# Altium schematic sheet ESP32-C3 module.SchDoc: ESP32-C3-WROOM-02
size A4; Organization: TechLabs Global (Pvt) Ltd; DocumentNumber: 2; Revision: 1.1; SheetNumber: 2; SheetTotal: 2
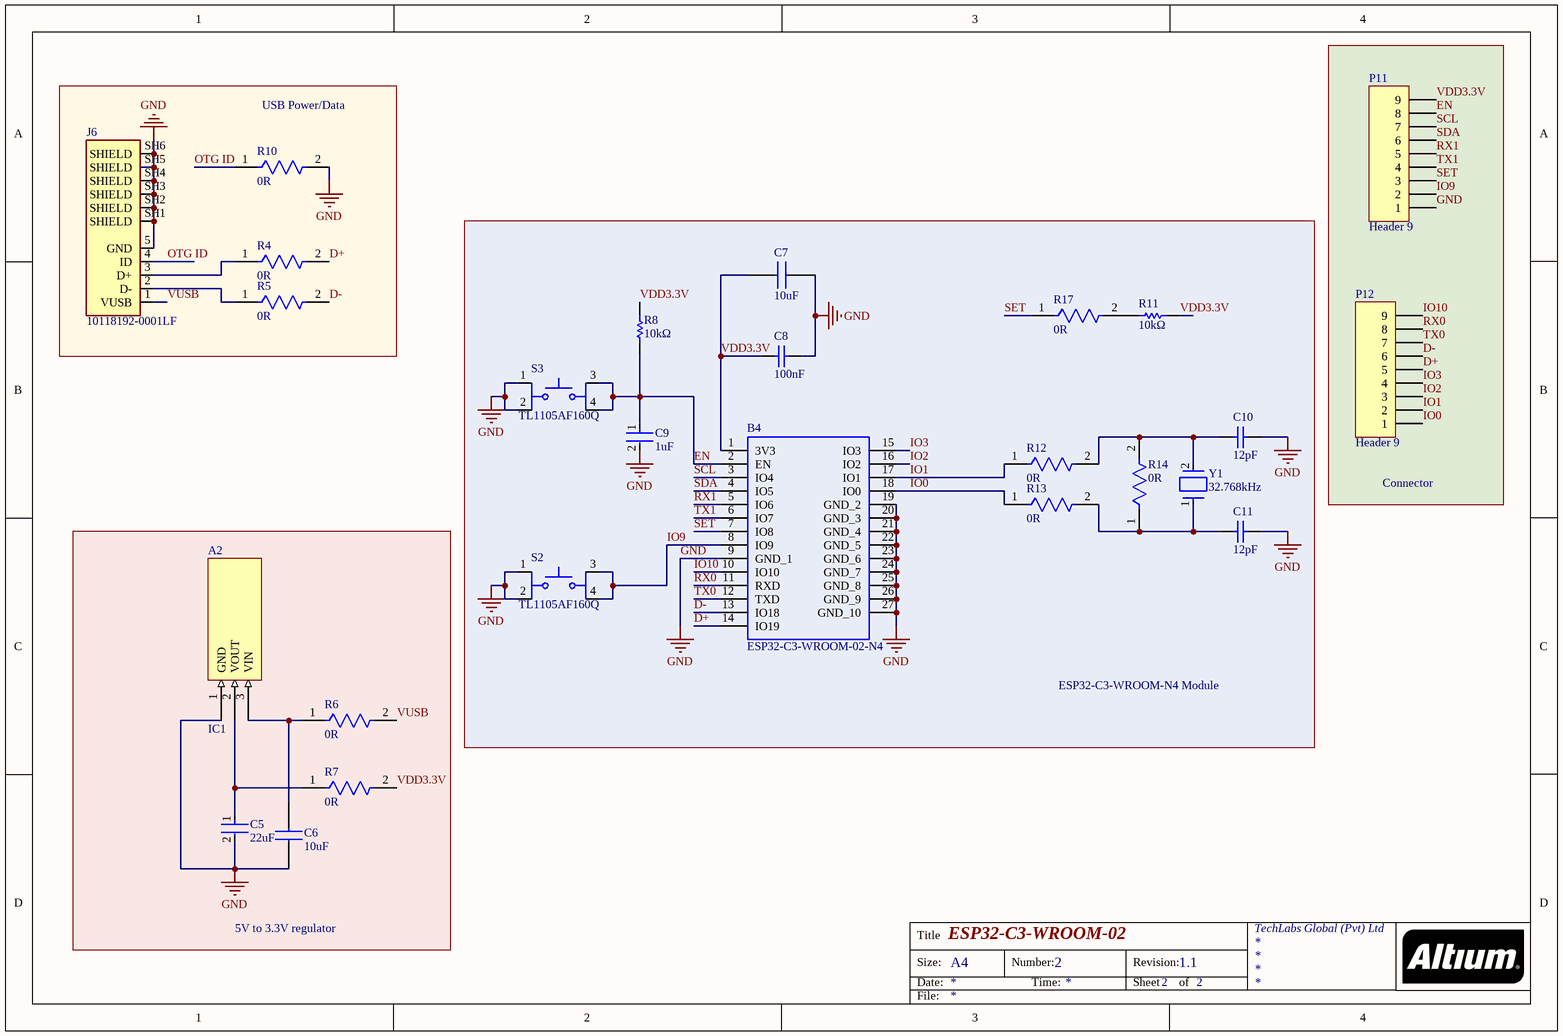
[diagram p0: ESP32-C3 module.SchDoc]

## Parts
A2  IC1  [SOT89-150P350X150-3N]
B4  ESP32-C3-WROOM-02-N4  [ESP32C3WROOM02N4]
C5  22uF  [FP-GRM219-0_2-0_15-IPC_A]
C6  10uF  [CL05A106MQ5NUNC]
C7  10uF  [CL05A106MQ5NUNC]
C8  100nF  [CAPC1050X55X23ML05T13]
C9  1uF  [FP-CL511-IPC_C]
C10  12pF  [CAPC1608X90X30LL10T20]
C11  12pF  [CAPC1608X90X30LL10T20]
J6  10118192-0001LF  [AMPHENOL_10118192-0001LF]
P11  Header 9  [HDR1X9]
P12  Header 9  [HDR1X9]
R4  0R  [FP-RC0402-0_4-IPC_A]
R5  0R  [FP-RC0402-0_4-IPC_A]
R6  0R  [FP-RC0402-0_4-IPC_A]
R7  0R  [FP-RC0402-0_4-IPC_A]
R8  10kΩ  [RESC1005X40X25LL05T10]
R10  0R  [FP-RC0402-0_4-IPC_A]
R11  10kΩ  [RESC1005X40X25LL05T10]
R12  0R  [FP-RC0402-0_4-IPC_A]
R13  0R  [FP-RC0402-0_4-IPC_A]
R14  0R  [FP-RC0402-0_4-IPC_A]
R17  0R  [FP-RC0402-0_4-IPC_A]
S2  TL1105AF160Q  [TL1105AF160Q]
S3  TL1105AF160Q  [TL1105AF160Q]
Y1  32.768kHz  [FP-ABS07-MFG]

## Blocks framed on the sheet
USB Power/Data: J6 R4 R5 R10
Connector: P11 P12
ESP32-C3-WROOM-N4 Module: B4 C7-C11 R8 R11-R14 R17 S2 S3 Y1
5V to 3.3V regulator: A2 C5 C6 R6 R7

## Nets
GND: A2.1(GND) B4.9(GND_1) B4.19(GND_2) B4.20(GND_3) B4.21(GND_4) B4.22(GND_5) B4.23(GND_6) B4.24(GND_7) B4.25(GND_8) B4.26(GND_9) B4.27(GND_10) C5.2 C6.1 C7.2 C8.2 C9.2 C10.2 C11.2 J6.5(GND) J6.SH1(SHIELD) J6.SH2(SHIELD) J6.SH3(SHIELD) J6.SH4(SHIELD) J6.SH5(SHIELD) J6.SH6(SHIELD) P11.1 R10.2 S2.1 S2.2 S3.1 S3.2
D+: B4.14(IO19) P12.5 R4.2
D-: B4.13(IO18) P12.6 R5.2
EN: B4.2(EN) C9.1 P11.8 R8.2 S3.3 S3.4
IO0: B4.18(IO0) P12.1 R13.1
IO1: B4.17(IO1) P12.2 R12.1
IO2: B4.16(IO2) P12.3
IO3: B4.15(IO3) P12.4
IO9: B4.8(IO9) P11.2 S2.3 S2.4
IO10: B4.10(IO10) P12.9
OTG ID: J6.4(ID) R10.1
RX0: B4.11(RXD) P12.8
RX1: B4.5(IO6) P11.5
SCL: B4.3(IO4) P11.7
SDA: B4.4(IO5) P11.6
SET: B4.7(IO8) P11.3 R17.1
TX0: B4.12(TXD) P12.7
TX1: B4.6(IO7) P11.4
VDD3.3V: B4.1(3V3) C7.1 C8.1 P11.9 R7.2 R8.1 R11.1
VUSB: J6.1(VUSB) R6.2
NetA2_2: A2.2(VOUT) C5.1 R7.1
NetA2_3: A2.3(VIN) C6.2 R6.1
NetC10_1: C10.1 R12.2 R14.2 Y1.2
NetC11_1: C11.1 R13.2 R14.1 Y1.1
NetJ6_2: J6.2(D-) R5.1
NetJ6_3: J6.3(D+) R4.1
NetR11_2: R11.2 R17.2

## Notes on the sheet
- Title
- Size:
- Date:
- A4
- Number:
- Time:
- Revision:
- Sheet
- of
- File:

## Library data of the parts
A2 = IC?: 75dB@(120Hz) 1A 1.25V@(1A) ±125℃@(Tj) Fixed 3.3V~3.3V Positive 1 20V SOT-89 Linear Voltage Regulators (LDO) ROHS; Manufacturer: YONGYUTAI; Mfr. Part #: AMS1117-3.3; LCSC Part #: C2904742; Package: SOT-89; Datasheet: https://datasheet.lcsc.com/lcsc/2110121330_YONGYUTAI-AMS1117-3-3_C2904742.pdf
B4 = ESP32-C3-WROOM-02-N4: WiFi Modules (802.11) (Engineering Samples) SMD module, ESP32-C3, 4MB SPI flash, PCB antenna, -40 C +85 C; Manufacturer: Espressif Systems; Mfr. Part #: ESP32-C3-WROOM-02-N4; LCSC Part #: C2934560; Datasheet: https://www.espressif.com/sites/default/files/documentation/esp32-c3-wroom-02_datasheet_en.pdf
C5 = CMP-06035-056251-1: Chip Multilayer Ceramic Capacitors for General Purpose, 0805, 22uF, X5R, 15%, 20%, 16V; Mfr. Part #: GRM219R61C226ME15L; Manufacturer: Murata Electronics; value: 22uF; Datasheet: https://datasheet.lcsc.com/lcsc/1811141821_Murata-Electronics-GRM219R61C226ME15L_C162295.pdf; LCSC Part #: C162295; Package: 0805
C6 C7 = CL05A106MQ5NUNC: 6.3V 10uF X5R ±20% 0402 Multilayer Ceramic Capacitors MLCC - SMD/SMT ROHS; Manufacturer: Samsung Electro-Mechanics; Mfr. Part #: CL05A106MQ5NUNC; LCSC Part #: C15525; value: 10uF; Datasheet Link: https://datasheet.datasheetarchive.com/originals/distributors/Datasheets-DGA10/2406160.pdf; Package: 0402
C8 = CMP-2000-05439-1: X7R 100nF 16V ±10% 0402 Multilayer Ceramic Capacitors MLCC - SMD/SMT ROHS; Manufacturer: Samsung Electro-Mechanics; Mfr. Part #: CL05B104KO5NNNC; Package: 0402; Value: 100nF; Datasheet: https://datasheet.lcsc.com/lcsc/1810191219_Samsung-Electro-Mechanics-CL05B104KO5NNNC_C1525.pdf; LCSC Part #: C1525
C9 = CMP-13271-001936-1: X5R 10V 1uF ±10% 0402 Multilayer Ceramic Capacitors MLCC - SMD/SMT ROHS; Manufacturer: Samsung Electro-Mechanics; Mfr. Part #: CL05A105KP5NNNC; Package: 0402; Value: 1uF; LCSC Part #: C14445; Datasheet: https://datasheet.lcsc.com/lcsc/1810191214_Samsung-Electro-Mechanics-CL05A105KP5NNNC_C14445.pdf
C10 C11 = CMP-2000-06098-1: 50V 12pF C0G ±5% 0603 Multilayer Ceramic Capacitors MLCC - SMD/SMT ROHS; Manufacturer: Samsung Electro-Mechanics; Mfr. Part #: CL10C120JB8NNNC; Datasheet: https://datasheet.lcsc.com/lcsc/1810261515_Samsung-Electro-Mechanics-CL10C120JB8NNNC_C38523.pdf; Package: 0603; LCSC Part #: C38523; Value: 12pF
J6 = 10118192-0001LF: Single Port 5 Contact Horizontal Right Angle Shielded Micro B USB 2.0 Connector; Manufacturer: Amphenol ICC; Mfr. Part #: 10118192-0001LF; Package: SMD; LCSC Part #: C132564; Datasheet: https://datasheet.lcsc.com/lcsc/2111290930_Amphenol-ICC-10118192-0001LF_C132564.pdf
P11 P12 = Header 9: Header, 9-Pin; LatestRevisionDate: 17-Jul-2002; LatestRevisionNote: Re-released for DXP Platform.; Publisher: Altium Limited
R4-R7 R10 R12-R14 R17 = CMP-2002-07342-2: RES SMD 0 OHM JUMPER 1/16W 0402; Manufacturer: Yageo; Mfr. Part #: RC0402FR-070RL; value: 0R; Package: 0402; LCSC Part #: C106231; Datasheet: https://www.lcsc.com/product-detail/Chip-Resistor-Surface-Mount_YAGEO-RC0402FR-070RL_C106231.html
R8 R11 = CMP-2002-07353-1: 50V 10kΩ Thick Film Resistors 62.5mW ±1% -55℃~+155℃ ±100ppm/℃ 0402 Chip Resistor - Surface Mount ROHS; Mfr. Part #: RC0402FR-0710KL; Manufacturer: YAGEO; Value: 10kΩ; LCSC Part #: C60490; Package: 0402
S2 S3 = TL1105AF160Q: 6mm 1.4mm Round Button 50mA Straight 6mm SPST 12V Plugin,6x6mm Tactile Switches ROHS; Manufacturer: E-Switch; Datasheet: https://datasheet.lcsc.com/lcsc/1809291031_E-Switch-TL1105AF160Q_C273465.pdf; Mfr. Part #: TL1105AF160Q; Package: Plugin,6x6mm; LCSC Part #: C273465
Y1 = CMP-0447-00001-4: -40℃~+85℃ 32.768kHz 12.5pF 70kΩ ±20ppm SMD3215-2P Crystals ROHS; Manufacturer: Abracon LLC; Mfr. Part #: ABS07-32.768KHZ-T; Value: 32.768kHz; LCSC Part #: C130253; Package: SMD3215-2P; Datasheet: https://datasheet.lcsc.com/lcsc/1809211224_Abracon-LLC-ABS07-32-768KHZ-T_C130253.pdf